# Altium schematic sheet Power.SchDoc
size A4; DocumentNumber: 3; SheetNumber: 3; SheetTotal: 5
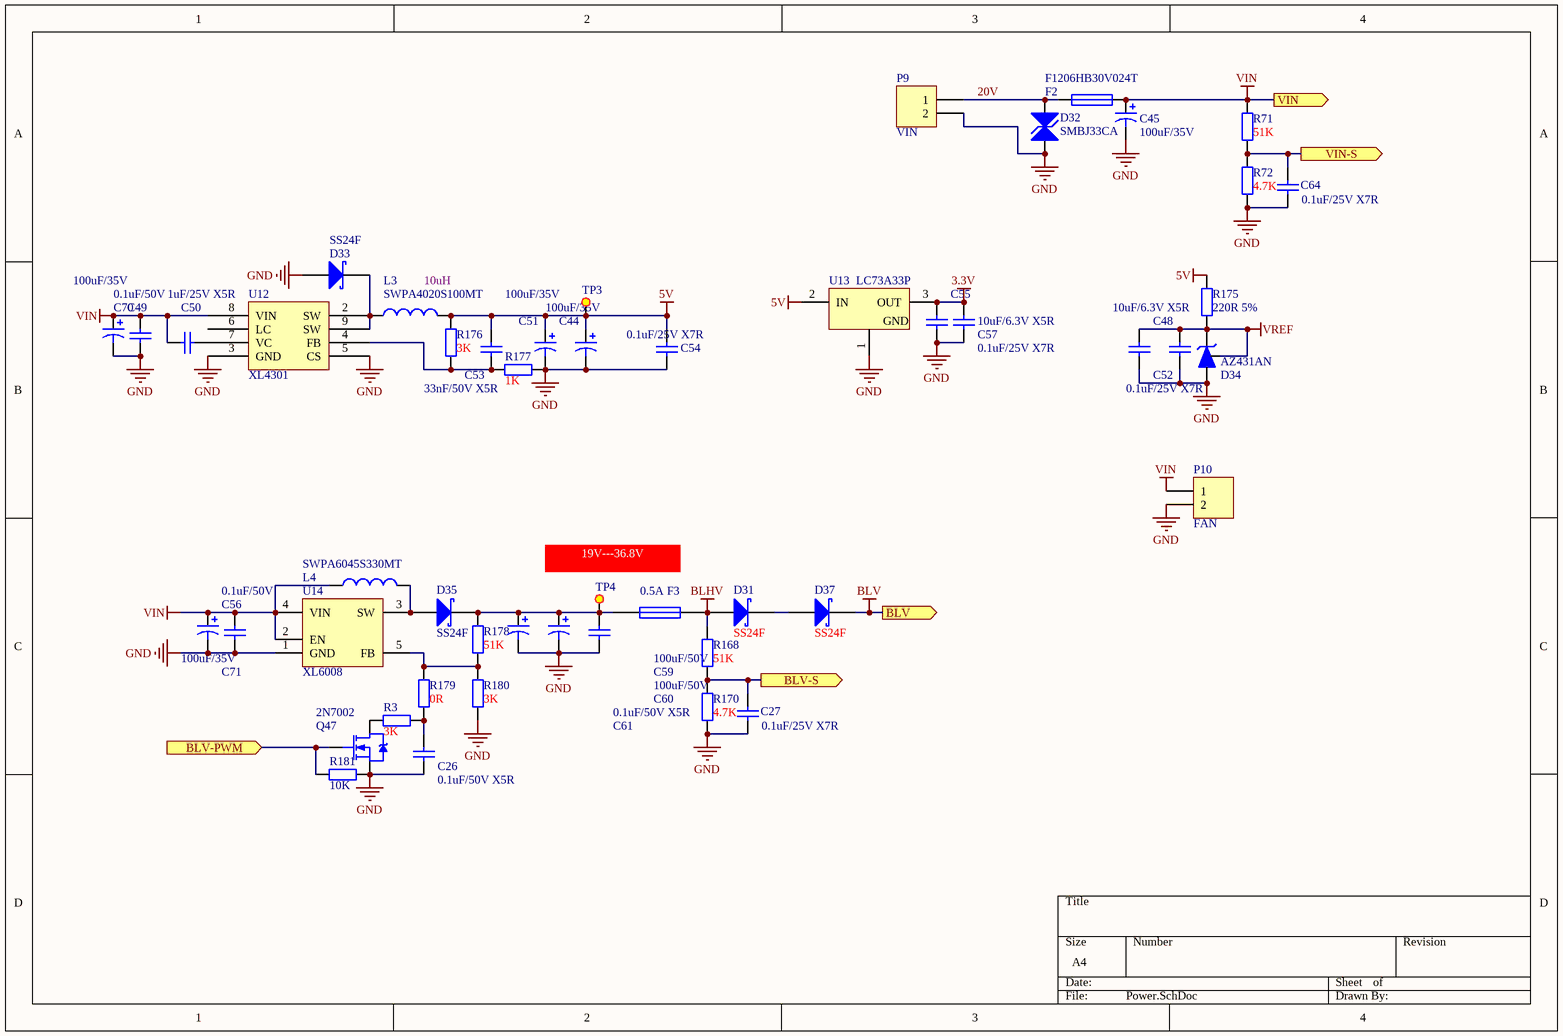
[diagram p0: Power.SchDoc]

## Parts
C26  0.1uF/50V X5R  [C-0603]
C27  0.1uF/25V X7R  [C-0603]
C44  100uF/35V  [CAP-SMD-6.3x7.7]
C45  100uF/35V  [CAP-SMD-6.3x7.7]
C48  10uF/6.3V X5R  [C-0603]
C49  0.1uF/50V  [C-0603]
C50  1uF/25V X5R  [C-0603]
C51  100uF/35V  [CAP-SMD-6.3x7.7]
C52  0.1uF/25V X7R  [C-0603]
C53  33nF/50V X5R  [C-0603]
C54  0.1uF/25V X7R  [C-0603]
C55  0.1uF/25V X7R  [C-0603]
C56  0.1uF/50V  [C-0603]
C57  10uF/6.3V X5R  [C-0603]
C59  100uF/50V  [CAPPR-8x12]
C60  100uF/50V  [CAPPR-8x12]
C61  0.1uF/50V X5R  [C-0603]
C64  0.1uF/25V X7R  [C-0603]
C70  100uF/35V  [CAP-SMD-6.3x7.7]
C71  100uF/35V  [CAP-SMD-6.3x7.7]
D31  SS24F  [SMAF]
D32  SMBJ33CA  [SMBJ]
D33  SS24F  [SMAF]
D34  AZ431AN  [SOT23-3]
D35  SS24F  [SMAF]
D37  SS24F  [SMAF]
F2  F1206HB30V024T  [R-1206]
F3  0.5A  [R-1206]
L3  SWPA4020S100MT  [SWPA4020S]
L4  SWPA6045S330MT  [SWPA6045S]
P9  VIN  [XT30U]
P10  FAN  [PH-2A]
Q47  2N7002  [SOT23-3]
R3  3K  [R-0603]
R71  51K  [R-0603]
R72  4.7K  [R-0603]
R168  51K  [R-0603]
R170  4.7K  [R-0603]
R175  220R 5%  [R-0603]
R176  3K  [R-0603]
R177  1K  [R-0603]
R178  51K  [R-0603]
R179  0R  [R-0603]
R180  3K  [R-0603]
R181  10K  [R-0603]
TP3  (no value)  [TestPoint-1.5mm]
TP4  (no value)  [TestPoint-1.5mm]
U12  XL4301  [SOIC8E]
U13  LC73A33P  [SOT89-3]
U14  XL6008  [TO252-5L]

## Ports
BLV (out), BLV-PWM (in), BLV-S (out), VIN (out), VIN-S (out)

## Nets
3.3V: C55.2 C57.2 U13.3(OUT)
5V: C44.1 C51.1 C53.1 C54.1 L3.2 R175.2 R176.1 TP3.1 U13.2(IN)
BLHV: D31.1(A) F3.2 R168.1
BLV: D37.2(K) ; port BLV
GND: C26.2 C27.1 C44.2 C45.2 C48.1 C49.1 C51.2 C52.2 C54.2 C55.1 C56.1 C57.1 C59.2 C60.2 C61.1 C64.1 C70.2 C71.2 D32.2 D33.1(A) D34.3(A) P9.2 P10.2 Q47.2(D) R72.1 R170.1 R177.2 R180.1 R181.1 U12.3(GND) U12.5(CS) U13.1(GND) U14.1(GND)
VIN: C45.1 C49.2 C50.2 C56.2 C70.1 C71.1 F2.1 L4.1 P10.1 R71.1 U12.8(VIN) U14.2(EN) U14.4(VIN) ; port VIN
VREF: C48.2 C52.1 D34.1(R) D34.2(K) R175.1
20V: D32.1 F2.2 P9.1
BLV-PWM: Q47.1(G) R181.2 ; port BLV-PWM
BLV-S: C27.2 R168.2 R170.2 ; port BLV-S
VIN-S: C64.2 R71.2 R72.2 ; port VIN-S
NetC26_1: C26.1 R3.1 R179.1
NetC50_1: C50.1 U12.7(VC)
NetC53_2: C53.2 R176.2 R177.1 U12.4(FB)
NetC59_1: C59.1 C60.1 C61.2 D35.2(K) F3.1 R178.1 TP4.1
NetD31_2: D31.2(K) D37.1(A)
NetD33_2: D33.2(K) L3.1 U12.2(SW) U12.9(SW)
NetD35_1: D35.1(A) L4.2 U14.3(SW)
NetQ47_3: Q47.3(S) R3.2
NetR178_2: R178.2 R179.2 R180.2 U14.5(FB)

Not connected (* = marked no-connect by the designer): U12 6(LC)

## Notes on the sheet
- 10uH
- 19V---36.8V

## Library data of the parts
C26 C27 C48-C50 C52-C57 C61 C64 = Cap: Capacitor; Published: 8-Jun-2000; LatestRevisionDate: 17-Jul-2002; LatestRevisionNote: Re-released for DXP Platform.; PackageReference: RAD-0.3; Publisher: Altium Limited
  C26 C61: PackageDescription: Radial Cap, Thru-Hole; 2 Leads; 0.3 in Pin Spacing; Value: 0.1uF/50V X5R
  C27 C52 C54 C64: PackageDescription: Radial Cap, Thru-Hole; 2 Leads; 0.3 in Pin Spacing; Value: 0.1uF/25V X7R
  C48: PackageDescription: Radial Cap, Thru-Hole; 2 Leads; 0.3 in Pin Spacing; Value: 10uF/6.3V X5R
  C49 C56: PackageDescription: Radial Cap, Thru-Hole; 2 Leads; 0.3 in Pin Spacing; Value: 0.1uF/50V
  C50: PackageDescription: Radial Cap, Thru-Hole; 2 Leads; 0.3 in Pin Spacing; Value: 1uF/25V X5R
  C53: PackageDescription: Radial Cap, Thru-Hole; 2 Leads; 0.3 in Pin Spacing; Value: 33nF/50V X5R
  C55: Value: 0.1uF/25V X7R
  C57: Value: 10uF/6.3V X5R
C44 C45 C51 C59 C60 C70 C71 = Cap Pol1: Polarized Capacitor (Radial); Published: 8-Jun-2000; LatestRevisionDate: 17-Jul-2002; LatestRevisionNote: Re-released for DXP Platform.; PackageReference: RB7.6-15; Publisher: Altium Limited; PackageDescription: Polarized Capacitor (Radial); 2 Leads
  C44 C45 C51 C70 C71: Value: 100uF/35V
  C59 C60: Value: 100uF/50V
D31 D33 D35 D37 = D Schottky: Schottky Diode; Manufacturer: Generic Components; Class: Discrete; SubClass: Diode - Schottky; Published: 08/06/2000; Publisher: Altium Hobart Technology Centre
D32 = TVS-D
D34 = TL431
F2 F3 = Fuse 1: Fuse; Published: 8-Jun-2000; LatestRevisionDate: 17-Jul-2002; LatestRevisionNote: Re-released for DXP Platform.; PackageReference: PIN-W2/E2.8; Publisher: Altium Limited; PackageDescription: Thru-Hole; 2 Leads
L3 L4 = Inductor: Code_IEC: 1005; Published: 8-Jun-2000; LatestRevisionDate: 29-May-2009; LatestRevisionNote: IPC-7351 Footprint Added.; PackageReference: 0402-A; Publisher: Altium Limited; PackageDescription: Chip Inductor; Code_JEITA: 0402
  L3: Value: SWPA4020S100MT
  L4: Value: SWPA6045S330MT
P9 P10 = Header 2: Header, 2-Pin; LatestRevisionDate: 17-Jul-2002; LatestRevisionNote: Re-released for DXP Platform.; Publisher: Altium Limited
Q47 = NMOS-2: N-Channel Power MOSFET; Note: Pin 2 is electrically connected to pin 4.; Published: 8-Jun-2000; LatestRevisionDate: 17-Jul-2002; LatestRevisionNote: Re-released for DXP Platform.; DatasheetVersion: PD-9.814; PackageVersion: Feb-1997; PackageReference: TO-220AB; Publisher: Altium Limited; PackageDescription: TO, Thru-Hole, Vertical, Heatsink Mounted; 3 In-Line Leads; Pitch 2.54 mm; ComponentLink1Description: Manufacturer Link; ComponentLink1URL: http://www.irf.com/
R3 R71 R72 R168 R170 R175-R181 = Res2: Resistor; Published: 8-Jun-2000; LatestRevisionDate: 17-Jul-2002; LatestRevisionNote: Re-released for DXP Platform.; PackageReference: AXIAL-0.4; Publisher: Altium Limited
  R3 R176 R180: Value: 3K
  R71 R168 R178: Value: 51K
  R72 R170: Value: 4.7K
  R175: Value: 220R 5%
  R177: Value: 1K
  R179: Value: 0R
  R181: Value: 10K
TP3 TP4 = TEST_P
U13 = LM7805